# Altium project HorsingAroundAccelSens.PrjPcb
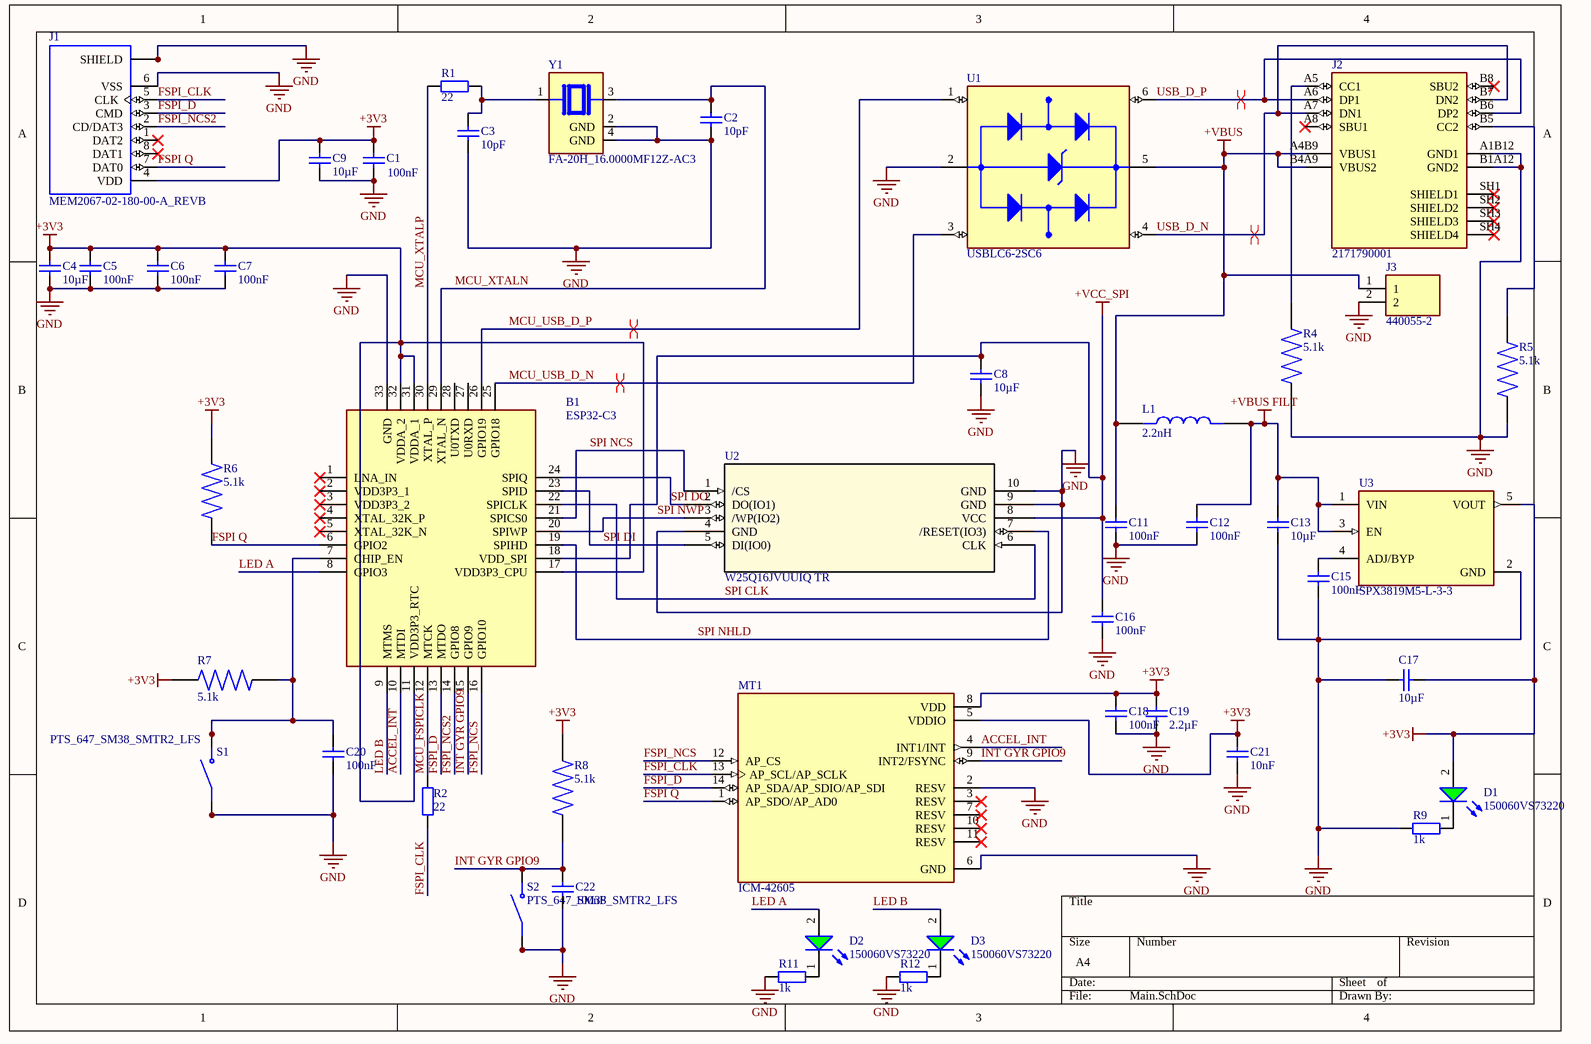
[diagram p0: Main.SchDoc]
1 sheet, 45 parts. Net scope: global (net labels, ports and power ports of the same name join across sheets).
Board file: Board_USB_powered.PcbDoc

## Sheet Main.SchDoc
size A4; SheetNumber: 1; SheetTotal: 2; SPICEModelCacheZLEYFKYG: <root> / <DocumentId>ZLEYFKYG</DocumentId> / <CacheFrame Number="0"> / <Model Name="0805_885012207016_100nf" Kind="CKT"> / <Text>******* / .subckt 0805_885012207016_100nF 1 2 / Rser 1 3 0.0162501221785 / Lser 2 4 0.000000000375 / C1 3 4 0.0000001 / Rpar 3 4 5000000000 / .ends 0805_885012207016_100nF</Text> / </Model> / <Model Name="1206_885012208018_10uf" Kind="CKT"> / <Text>******* / .subckt 1206_885012208018_10uF 1 2 / Rser 1 3 0.00288901435933 / Lser 2 4 7.48356777E-10 / C1 3 4 0.00001 / Rpar 3 4 10000000 / .ends 1206_885012208018_10uF</Text> / </Model> / <Model Name="1206_885012008037_10pf" Kind="CKT"> / <Text>******* / .subckt 1206_885012008037_10pF 1 2 / Rser 1 3 0.247786722229 / Lser 2 4 5.75498755E-10 / C1 3 4 0.00000000001 / Rpar 3 4 10000000000 / .ends 1206_885012008037_10pF</Text> / </Model> / <Model Name="0603_150060vs73220" Kind="CKT"> / <Text>******************************* / .subckt 0603_150060VS73220 1 2 / D1 1 2 SMCC / .MODEL SMCC D / + IS=405.27E-18 / + N=2.1772 / + RS=.76388 / + IKF=194.19E-6 / + CJO=1.0000E-12 / + M=.3333 / + VJ=.75 / + BV=5 / + IBV=100.00E-6 / + TT=5.0000E-9 / .ends</Text> / </Model> / <Model Name="0805_885012107012_2.2uf" Kind="CKT"> / <Text>******* / .subckt 0805_885012107012_2.2uF 1 2 / Rser 1 3 0.0046352610288 / Lser 2 4 2.55261723E-10 / C1 3 4 0.0000022 / Rpar 3 4 50000000 / .ends 0805_885012107012_2.2uF</Text> / </Model> / <Model Name="0805_885012007009_10nf" Kind="CKT"> / <Text>******* / .subckt 0805_885012007009_10nF 1 2 / Rser 1 3 0.0143302506767 / Lser 2 4 2.53788056E-10 / C1 3 4 0.00000001 / Rpar 3 4 10000000000 / .ends 0805_885012007009_10nF</Text> / </Model> / </CacheFrame> / </root>

### Parts
B1  ESP32-C3  [QFN50P500X500X90-33N-D]
C1  value 100nF  [WCAP-CSGP_0805_L2W1.25H0.8_Reflow]  (hidden comment: 885012207016)
C2  value 10pF  [WCAP-CSGP_1206_L3.2W1.6H0.8]  (hidden comment: 885012008037)
C3  value 10pF  [WCAP-CSGP_1206_L3.2W1.6H0.8]  (hidden comment: 885012008037)
C4  value 10µF  [WCAP-CSGP_1206_L3.2W1.6H1.6]  (hidden comment: 885012208018)
C5  value 100nF  [WCAP-CSGP_0805_L2W1.25H0.8_Reflow]  (hidden comment: 885012207016)
C6  value 100nF  [WCAP-CSGP_0805_L2W1.25H0.8_Reflow]  (hidden comment: 885012207016)
C7  value 100nF  [WCAP-CSGP_0805_L2W1.25H0.8_Reflow]  (hidden comment: 885012207016)
C8  value 10µF  [WCAP-CSGP_1206_L3.2W1.6H1.6]  (hidden comment: 885012208018)
C9  value 10µF  [WCAP-CSGP_1206_L3.2W1.6H1.6]  (hidden comment: 885012208018)
C11  value 100nF  [WCAP-CSGP_0805_L2W1.25H0.8_Reflow]  (hidden comment: 885012207016)
C12  value 100nF  [WCAP-CSGP_0805_L2W1.25H0.8_Reflow]  (hidden comment: 885012207016)
C13  value 10µF  [WCAP-CSGP_1206_L3.2W1.6H1.6]  (hidden comment: 885012208018)
C15  value 100nF  [WCAP-CSGP_0805_L2W1.25H0.8_Reflow]  (hidden comment: 885012207016)
C16  value 100nF  [WCAP-CSGP_0805_L2W1.25H0.8_Reflow]  (hidden comment: 885012207016)
C17  value 10µF  [WCAP-CSGP_1206_L3.2W1.6H1.6]  (hidden comment: 885012208018)
C18  value 100nF  [WCAP-CSGP_0805_L2W1.25H0.8_Reflow]  (hidden comment: 885012207016)
C19  value 2.2µF  [WCAP-CSGP_0805_L2W1.25H1.25]  (hidden comment: 885012107012)
C20  value 100nF  [WCAP-CSGP_0805_L2W1.25H0.8_Reflow]  (hidden comment: 885012207016)
C21  value 10nF  [WCAP-CSGP_0805_L2W1.25H1.25]  (hidden comment: 885012007009)
C22  value 100nF  [WCAP-CSGP_0805_L2W1.25H0.8_Reflow]  (hidden comment: 885012207016)
D1  150060VS73220  [WL-SMCC_0603_L1.6W0.8H0.2]
D2  150060VS73220  [WL-SMCC_0603_L1.6W0.8H0.2]
D3  150060VS73220  [WL-SMCC_0603_L1.6W0.8H0.2]
J1  MEM2067-02-180-00-A_REVB  [GCT_MEM2067-02-180-00-A_REVB]
J2  2171790001  [MOLEX_2171790001]
J3  440055-2  [TE_440055-2]
L1  value 2.2nH  [INDC0402X22N]  (hidden comment: MHQ0402PSA2N2BT000)
MT1  ICM-42605  [XDCR_ICM-42605]
R1  value 22  [WRIS-RSKS_0603_Reflow]  (hidden comment: 560112116043)
R2  value 22  [WRIS-RSKS_0603_Reflow]  (hidden comment: 560112116043)
R4  value 5.1k  [RESC2012X60N]  (hidden comment: RC0805JR-075K1L)
R5  value 5.1k  [RESC2012X60N]  (hidden comment: RC0805JR-075K1L)
R6  value 5.1k  [RESC2012X60N]  (hidden comment: RC0805JR-075K1L)
R7  value 5.1k  [RESC2012X60N]  (hidden comment: RC0805JR-075K1L)
R8  value 5.1k  [RESC2012X60N]  (hidden comment: RC0805JR-075K1L)
R9  value 1k  [WRIS-RSKS_0603_Reflow]  (hidden comment: 560112116014)
R11  value 1k  [WRIS-RSKS_0603_Reflow]  (hidden comment: 560112116014)
R12  value 1k  [WRIS-RSKS_0603_Reflow]  (hidden comment: 560112116014)
S1  PTS_647_SM38_SMTR2_LFS  [SW_PTS_647_SM38_SMTR2_LFS]
S2  PTS_647_SM38_SMTR2_LFS  [SW_PTS_647_SM38_SMTR2_LFS]
U1  USBLC6-2SC6  [SOT95P280X145-6N]
U2  W25Q16JVUUIQ TR  [USON8_4X3_UU_WIN]
U3  SPX3819M5-L-3-3  [SOT95P280X145-5N]
Y1  FA-20H_16.0000MF12Z-AC3  [XTAL_FA-20H_16.0000MF12Z-AC3]

### Nets
+3V3: B1.11(VDD3P3_RTC) B1.17(VDD3P3_CPU) B1.31(VDDA_1) B1.32(VDDA_2) C1.2 C4.2 C5.2 C6.2 C7.2 C9.2 C17.1 C18.2 C19.2 C21.2 D1.2(A) J1.4(VDD) MT1.5(VDDIO) MT1.8(VDD) R6.1 R7.1 R8.2 U3.5(VOUT)
+VBUS: C11.2 J2.A4B9(VBUS1) J2.B4A9(VBUS2) J3.1 L1.1 U1.5(VBUS)
+VBUS FILT: C12.2 C13.2 L1.2 U3.1(VIN) U3.3(EN)
+VCC_SPI: B1.18(VDD_SPI) C8.2 C16.2 U2.8(VCC)
GND: B1.33(GND) C1.1 C2.2 C3.2 C4.1 C5.1 C6.1 C7.1 C8.1 C9.1 C11.1 C12.1 C13.1 C15.1 C16.1 C17.2 C18.1 C19.1 C20.1 C21.1 C22.1 J1.6(VSS) J1.9(SHIELD) J1.10(SHIELD) J1.11(SHIELD) J1.12(SHIELD) J2.A1B12(GND1) J2.B1A12(GND2) J3.2 MT1.2(RESV) MT1.6(GND) R4.1 R5.1 R9.1 R11.1 R12.1 S1.3(COM) S1.4(COM) S2.3(COM) S2.4(COM) U1.2(GND) U2.4(GND) U2.9(GND) U2.10(GND) U3.2(GND) Y1.2(GND) Y1.4(GND)
ACCEL_INT: B1.10(MTDI) MT1.4(INT1/INT)
FSPI Q: B1.6(GPIO2) J1.7(DAT0) MT1.1(AP_SDO/AP_AD0) R6.2
FSPI_CLK: J1.5(CLK) MT1.13(AP_SCL/AP_SCLK) R2.1
FSPI_D: B1.13(MTDO) J1.3(CMD) MT1.14(AP_SDA/AP_SDIO/AP_SDI)
FSPI_NCS: B1.16(GPIO10) MT1.12(AP_CS)
FSPI_NCS2: B1.14(GPIO8) J1.2(CD/DAT3)
INT GYR GPIO9: B1.15(GPIO9) C22.2 MT1.9(INT2/FSYNC) R8.1 S2.1(NO) S2.2(NO)
LED A: B1.8(GPIO3) D2.2(A)
LED B: B1.9(MTMS) D3.2(A)
MCU_FSPICLK: B1.12(MTCK) R2.2
MCU_USB_D_N: B1.25(GPIO18) U1.3(I/O2_IN)
MCU_USB_D_P: B1.26(GPIO19) U1.1(I/O1_IN)
MCU_XTALN: B1.29(XTAL_N) C2.1 Y1.3
MCU_XTALP: B1.30(XTAL_P) R1.1
SPI CLK: B1.22(SPICLK) U2.6(CLK)
SPI DI: B1.23(SPID) U2.5(DI(IO0))
SPI DO: B1.24(SPIQ) U2.2(DO(IO1))
SPI NCS: B1.21(SPICS0) U2.1(/CS)
SPI NHLD: B1.19(SPIHD) U2.7(/RESET(IO3))
SPI NWP: B1.20(SPIWP) U2.3(/WP(IO2))
USB_D_N: J2.A7(DN1) J2.B7(DN2) U1.4(I/O2_OUT)
USB_D_P: J2.A6(DP1) J2.B6(DP2) U1.6(I/O1_OUT)
NetB1_7: B1.7(CHIP_EN) C20.2 R7.2 S1.1(NO) S1.2(NO)
NetC3_1: C3.1 R1.2 Y1.1
NetC15_2: C15.2 U3.4(ADJ/BYP)
NetD1_1: D1.1(K) R9.2
NetD2_1: D2.1(K) R11.2
NetD3_1: D3.1(K) R12.2
NetJ2_A5: J2.A5(CC1) R4.2
NetJ2_B5: J2.B5(CC2) R5.2

Not connected (* = marked no-connect by the designer): B1 1(LNA_IN)* 2(VDD3P3_1)* 3(VDD3P3_2)* 4(XTAL_32K_P)* 5(XTAL_32K_N)* 27(U0RXD) 28(U0TXD); J1 1(DAT2)* 8(DAT1)*; J2 A8(SBU1)* B8(SBU2)* SH1(SHIELD1)* SH2(SHIELD2)* SH3(SHIELD3)* SH4(SHIELD4)*; MT1 3(RESV)* 7(RESV)* 10(RESV)* 11(RESV)*

### Layout directives
differential pair: MCU_USB_D_N, MCU_USB_D_P, USB_D_N, USB_D_P

### Library data of the parts
B1 = CMP-628-000001-2: Ultra-Low-Power SoC with RISC-V Single-Core CPU; Manufacturer_Name: Espressif Systems; Geometry.Height: 0.9mm; Datasheet Link: https://www.espressif.com/sites/default/files/documentation/esp32-c3_datasheet_en.pdf; Source: ESP32-C3.SchLib; Design Item ID: ESP32-C3; Mouser Price/Stock: https://www.mouser.co.uk/ProductDetail/Espressif-Systems/ESP32-C3?qs=iLbezkQI%252BsiMXe7tMG%252Bo%2FA%3D%3D; Manufacturer_Part_Number: ESP32-C3; Mouser Part Number: 356-ESP32-C3
C1 C5-C7 C11 C12 C15 C16 C18 C20 C22 = CMP-001-07966-1: WCAP-CSGP Multilayer Ceramic Chip Capacitor, General Purpose, size 0805, X7R, 100nF, 10VDC; Manufacturer: Wurth Elektronik; Capacitance Tolerance: +/-10%; Technical Reference: X7R0805104K010DFCT10000; Insulation Resistance: 5GO; Rated Voltage (DC): 10V; Dissipation Factor: 5%; Category: Multilayer Ceramic Chip Capacitors; ComponentLink1Description: Website Link; Mount: Surface Mount; Packaging: Tape and Reel; ComponentLink1URL: https://www.we-online.com/redexpert/article/885012207016?ad; Length: 2mm; ComponentLink2Description: Datasheet Link; Pins: 2; Operating Temperature Max: 125°C; Case/Package: 0805; Design Item ID: 885012207016; Component Type: Standard; Height: 0.8mm; Ceramic Type: X7R; Match Code: WCAP-CSGP; Width: 1.25mm; Manufacturer Part Number: 885012207016; Operating Temperature Min: -55°C; ComponentLink2URL: https://www.we-online.com/redexpert/spec/885012207016?ad; Source: WCAP-CSGP.SchLib
C2 C3 = CMP-001-09392-1: WCAP-CSGP Multilayer Ceramic Chip Capacitor, General Purpose, size 1206, NP0, 10pF, 50VDC; Manufacturer: Wurth Elektronik; Capacitance Tolerance: +/-5%; Q Factor: 600; Rated Voltage (DC): 50V; Technical Reference: NP01206100J050DFCT10000; Insulation Resistance: 10GOhm; ComponentLink1Description: Website Link; Case/Package: 1206; Category: Multilayer Ceramic Chip Capacitors; Operating Temperature Max: 125°C; Manufacturer Part Number: 885012008037; Match Code: WCAP-CSGP; Design Item ID: 885012008037; Height: 0.8mm; Length: 3.2mm; Mount: Surface Mount; Source: WCAP-CSGP.SchLib; Width: 1.6mm; ComponentLink1URL: https://www.we-online.com/redexpert/article/885012008037?ad; Pins: 2; ComponentLink2Description: Datasheet Link; Ceramic Type: NP0; Packaging: Tape and Reel; ComponentLink2URL: https://www.we-online.com/redexpert/spec/885012008037?ad; Component Type: Standard; Operating Temperature Min: -55°C
C4 C8 C9 C13 C17 = CMP-001-09916-1: WCAP-CSGP Multilayer Ceramic Chip Capacitor, General Purpose, size 1206, X7R, 10uF, 10VDC; Manufacturer: Wurth Elektronik; Insulation Resistance: 0.01GOhm; Rated Voltage (DC): 10V; Dissipation Factor: 10%; Capacitance Tolerance: +/-10%; Technical Reference: X7R1206106K010DFCT10000; Pins: 2; Ceramic Type: X7R; Width: 1.6mm; Height: 1.6mm; Case/Package: 1206; Match Code: WCAP-CSGP; Operating Temperature Min: -55°C; Design Item ID: 885012208018; Category: Multilayer Ceramic Chip Capacitors; Manufacturer Part Number: 885012208018; Source: WCAP-CSGP.SchLib; Mount: Surface Mount; Packaging: Tape and Reel; Component Type: Standard; ComponentLink2URL: https://www.we-online.com/redexpert/spec/885012208018?ad; ComponentLink2Description: Datasheet Link; ComponentLink1URL: https://www.we-online.com/redexpert/article/885012208018?ad; ComponentLink1Description: Website Link; Operating Temperature Max: 125°C; Length: 3.2mm
C19 = CMP-001-09534-1: WCAP-CSGP Multilayer Ceramic Chip Capacitor, General Purpose, size 0805, X5R, 2.2uF, 16VDC; Manufacturer: Wurth Elektronik; Insulation Resistance: 0.05GOhm; Rated Voltage (DC): 16V; Technical Reference: X5R0805225M016DFCT10000; Capacitance Tolerance: +/-20%; Dissipation Factor: 10%; Case/Package: 0805; Height: 1.25mm; Ceramic Type: X5R; ComponentLink2URL: https://www.we-online.com/redexpert/spec/885012107012?ad; Width: 1.25mm; Packaging: Tape and Reel; ComponentLink2Description: Datasheet Link; Mount: Surface Mount; ComponentLink1Description: Website Link; Component Type: Standard; Manufacturer Part Number: 885012107012; Pins: 2; Category: Multilayer Ceramic Chip Capacitors; Match Code: WCAP-CSGP; ComponentLink1URL: https://www.we-online.com/redexpert/article/885012107012?ad; Source: WCAP-CSGP.SchLib; Design Item ID: 885012107012; Length: 2mm; Operating Temperature Max: 85°C; Operating Temperature Min: -55°C
C21 = CMP-001-09275-1: WCAP-CSGP Multilayer Ceramic Chip Capacitor, General Purpose, size 0805, NP0, 10nF, 10VDC; Manufacturer: Wurth Elektronik; Q Factor: 1000; Capacitance Tolerance: +/-5%; Technical Reference: NP00805103J010DFCT10000; Rated Voltage (DC): 10V; Insulation Resistance: 10GOhm; ComponentLink1Description: Website Link; Source: WCAP-CSGP.SchLib; Ceramic Type: NP0; Case/Package: 0805; Match Code: WCAP-CSGP; Mount: Surface Mount; Operating Temperature Max: 125°C; Pins: 2; ComponentLink2Description: Datasheet Link; Component Type: Standard; Operating Temperature Min: -55°C; Width: 1.25mm; Design Item ID: 885012007009; ComponentLink1URL: https://www.we-online.com/redexpert/article/885012007009?ad; Height: 1.25mm; Packaging: Tape and Reel; Length: 2mm; Category: Multilayer Ceramic Chip Capacitors; Manufacturer Part Number: 885012007009; ComponentLink2URL: https://www.we-online.com/redexpert/spec/885012007009?ad
D1-D3 = CMP-004-00631-1: WL-SMCC Mono-color Chip LED Compact, size 0603, Bright Green, 2V, 120°; Manufacturer: Wurth Elektronik; Peak Wavelength: 575nm; Dominant Wavelength: 573nm; Luminous Intensity: 60mcd; Chip Technology: AlInGaP; ComponentLink2Description: Datasheet Link; Operating Temperature Max: 85°C; Mount: Surface Mount; Operating Temperature Min: -40°C; Viewing Angle: 120°; Design Item ID: 150060VS73220; ComponentLink1Description: Website Link; Match Code: WL-SMCC; Source: WL-SMCC.SchLib; Packaging: Tape and Reel; Forward Voltage: 2V; Pins: 2; ComponentLink2URL: https://www.we-online.com/redexpert/spec/150060VS73220?ad; Case/Package: 0603; Manufacturer Part Number: 150060VS73220; Component Type: Standard; Length: 1.6mm; ComponentLink1URL: https://www.we-online.com/redexpert/article/150060VS73220?ad; Emitting Color: Bright Green; Width: 0.8mm; Category: Signal LEDs; Height: 0.2mm
J1 = CMP-002-03438-2: Micro SD Memory Card ConnectorSMT, Hinged, 1.80mm Profile; Pins: 12; Design Item ID: MEM2067-02-180-00-A_REVB; Availability: Unavailable; Price: None; Value: *; MP: MEM2067-02-180-00-A_REVB; Component Type: Standard; Case/Package: None; Source: MEM2067-02-180-00-A_REVB.SchLib
J2 = CMP-002-03437-2: USB Type C - Connector, Top-mount SMT, 16pos; MF: Molex; MP: 217179-0001; Value: *; Check_prices: https://www.snapeda.com/parts/217179-0001/Molex/view-part/?ref=eda; Component Type: Standard; Pins: 16; Case/Package: None; SnapEDA_Link: https://www.snapeda.com/parts/217179-0001/Molex/view-part/?ref=snap; Source: 2171790001.SchLib; Design Item ID: 2171790001
J3 = CMP-002-03439-1: 2.0MM,HDR,2POS,R/A; Product_Type: Connector; MF: TE Connectivity; Number_of_Positions: 2; Centerline_Pitch: 2 mm[.079 in]; Component Type: Standard; Value: *; EU_RoHS_Compliance: Compliant; Check_prices: https://www.snapeda.com/parts/440055-2/TE+Connectivity+AMP+Connectors/view-part/?ref=eda; Case/Package: None; Design Item ID: 440055-2; SnapEDA_Link: https://www.snapeda.com/parts/440055-2/TE+Connectivity+AMP+Connectors/view-part/?ref=snap; MP: 440055-2; Source: 440055-2.SchLib; Pins: 2
L1 = CMP-006-00905-1: 2.2 nH Shielded Multilayer Inductor 400 mA 400mOhm Max 01005 (0402 Metric); MF: {'manufacturer': u'TDK Corporation'}; Component Type: Standard; Availability: Unavailable; MP: MHQ0402PSA2N2BT000; Case/Package: None; Source: MHQ0402PSA2N2BT000.SchLib; Price: None; Design Item ID: MHQ0402PSA2N2BT000; Pins: 2
MT1 = CMP-010-00024-1: Pins: 14; Source: ICM-42605.SchLib; Value: *; Component Type: Standard; Price: None; Availability: Unavailable; MP: ICM-42605; Case/Package: None; Design Item ID: ICM-42605
R1 R2 = CMP-009-00537-1: WRIS-RSKS Thick Film Resistor, size 0603, 22Ohm, 100mW; Manufacturer: Wurth Elektronik; Limiting Element Voltage: 75V; Resistance Tolerance: +/-5%; Temperature Coefficient of Resistance Min: -100ppm/°C; Temperature Coefficient of Resistance Max: 100ppm/°C; Length: 1.6mm; Packaging: Tape and Reel; ComponentLink2Description: Datasheet Link; Source: WRIS-RSKS.SchLib; Mount: Surface Mount; ComponentLink2URL: https://www.we-online.com/redexpert/spec/560112116043?ad; Operating Temperature Min: -55°C; Height: 0.45mm; Case/Package: 0603; Match Code: WRIS-RSKS; Component Type: Standard; ComponentLink1URL: https://www.we-online.com/redexpert/article/560112116043?ad; Manufacturer Part Number: 560112116043; Rated Power: 100mW; Pins: 2; Width: 0.8mm; Design Item ID: 560112116043; Category: Thick Film Resistors; Operating Temperature Max: 155°C; ComponentLink1Description: Website Link
R4-R8 = CMP-009-00765-1: RC0805 5,1K 5% 0,125W; MP: RC0805JR-075K1L; Availability: Unavailable; Source: RC0805JR-075K1L.SchLib; Pins: 2; Component Type: Standard; Design Item ID: RC0805JR-075K1L; Case/Package: None; Price: None
R9 R11 R12 = CMP-009-00508-1: WRIS-RSKS Thick Film Resistor, size 0603, 1000Ohm, 100mW; Manufacturer: Wurth Elektronik; Resistance Tolerance: +/-1%; Temperature Coefficient of Resistance Min: -100ppm/°C; Limiting Element Voltage: 75V; Temperature Coefficient of Resistance Max: 100ppm/°C; Category: Thick Film Resistors; ComponentLink1Description: Website Link; ComponentLink1URL: https://www.we-online.com/redexpert/article/560112116014?ad; Rated Power: 100mW; Operating Temperature Max: 155°C; ComponentLink2Description: Datasheet Link; Mount: Surface Mount; Design Item ID: 560112116014; Length: 1.6mm; Width: 0.8mm; Source: WRIS-RSKS.SchLib; ComponentLink2URL: https://www.we-online.com/redexpert/spec/560112116014?ad; Operating Temperature Min: -55°C; Case/Package: 0603; Packaging: Tape and Reel; Match Code: WRIS-RSKS; Height: 0.45mm; Manufacturer Part Number: 560112116014; Pins: 2; Component Type: Standard
S1 S2 = CMP-011-00590-2: Tactile Switch SPST-NO Top Actuated Surface Mount; MF: C&K; MP: PTS 647 SM38 SMTR2 LFS; Value: *; Purchase-URL: https://pricing.snapeda.com/search/part/PTS 647 SM38 SMTR2 LFS/?ref=eda; Case/Package: None; Source: PTS_647_SM38_SMTR2_LFS.SchLib; Digi-Key_Part_Number: PTS647SM38SMTR2LFSTR-ND; Pins: 4; Component Type: Standard; SnapEDA_Link: https://www.snapeda.com/parts/PTS%20647%20SM38%20SMTR2%20LFS/C%2526K/view-part/?ref=snap; Check_prices: https://www.snapeda.com/parts/PTS%20647%20SM38%20SMTR2%20LFS/C%2526K/view-part/?ref=eda; Design Item ID: PTS_647_SM38_SMTR2_LFS
U1 = CMP-004-00696-1: 17V Clamp 5A (8/20Âµs) Ipp Tvs Diode Surface Mount SOT-23-6; MF: STMicroelectronics; Design Item ID: USBLC6-2SC6; Value: *; Price: None; Pins: 6; SnapEDA_Link: https://www.snapeda.com/parts/USBLC6-2SC6/STMicroelectronics/view-part/?ref=snap; MP: USBLC6-2SC6; Availability: In Stock; Purchase-URL: https://pricing.snapeda.com/search/part/USBLC6-2SC6/?ref=eda; Component Type: Standard; Source: USBLC6-2SC6.SchLib; Check_prices: https://www.snapeda.com/parts/USBLC6-2SC6/STMicroelectronics/view-part/?ref=eda; Case/Package: SOT-23-6 STMicroelectronics
U2 = CMP-019-00050-1: No Description Available; Mfr_Name: Winbond; Design Item ID: W25Q16JVUUIQ TR; RefDes: RefDes; Source: W25Q16JVUUIQTR.SchLib; Type: Type
U3 = CMP-031-01210-1: Linear Voltage Regulator IC Positive Fixed 1 Output 500mA SOT-23-5; MF: MaxLinear, Inc.; MP: SPX3819M5-L-3-3/TR; Design Item ID: SPX3819M5-L-3-3; Component Type: Standard; Pins: 5; Value: *; Check_prices: https://www.snapeda.com/parts/SPX3819M5-L-3-3/TR/MaxLinear%252C+Inc./view-part/?ref=eda; SnapEDA_Link: https://www.snapeda.com/parts/SPX3819M5-L-3-3/TR/MaxLinear%252C+Inc./view-part/?ref=snap; Source: SPX3819M5-L-3-3.SchLib; Case/Package: SOT-23-5 Exar
Y1 = CMP-003-00337-1: 16 MHz Â±10ppm Crystal 9pF 80 Ohms 4-SMD, No Lead; MP: FA-20H 16.0000MF12Z-AC3; MF: EPSON; Design Item ID: FA-20H_16.0000MF12Z-AC3; Value: *; Check_prices: https://www.snapeda.com/parts/FA-20H%2016.0000MF12Z-AC3/EPSON/view-part/?ref=eda; SnapEDA_Link: https://www.snapeda.com/parts/FA-20H%2016.0000MF12Z-AC3/EPSON/view-part/?ref=snap; Purchase-URL: https://pricing.snapeda.com/search/part/FA-20H 16.0000MF12Z-AC3/?ref=eda; Source: FA-20H_16.0000MF12Z-AC3.SchLib; Price: None; Pins: 4; Case/Package: NON STANDARD-4 EPSON; Availability: In Stock; Component Type: Standard